# Altium schematic sheet 工大宣区_气温.SchDoc
size A4
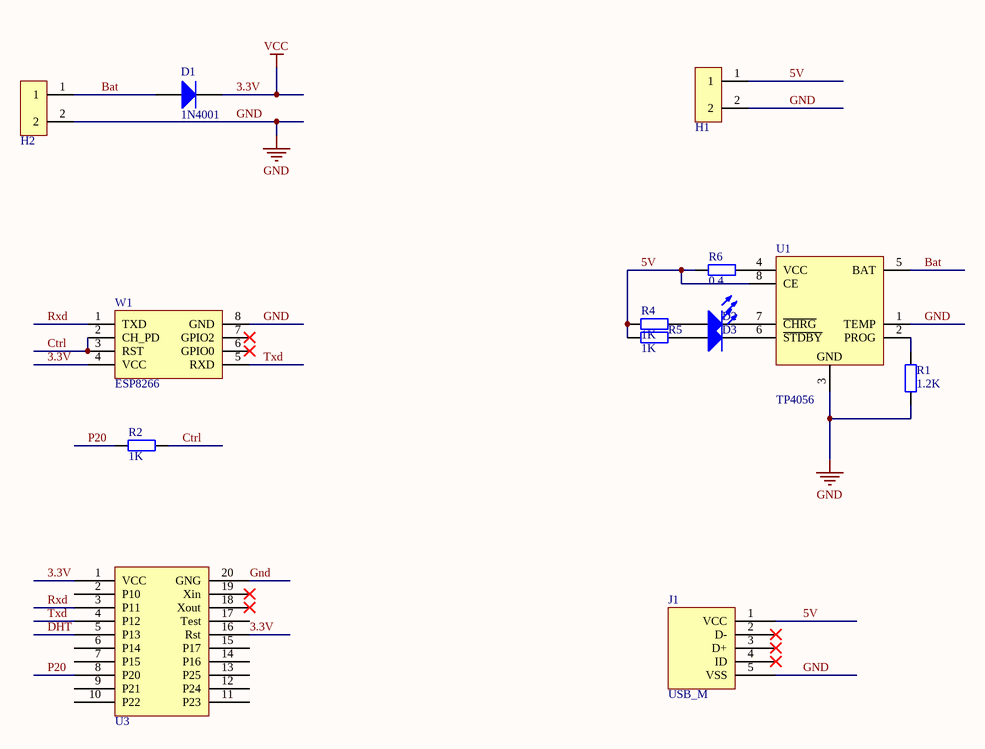
[diagram p0: 工大宣区_气温.SchDoc]

## Parts
D1  Type: 1N4001  [DIODE-1206]  (hidden comment: Diode)
D2  LED0  [LED_A2]  (value not drawn)
D3  LED0  [LED_A2]  (value not drawn)
H1  Header_2_5.04  [Header_2_5.04]  (value not drawn)
H2  Header_2_5.04  [Header_2_5.04]  (value not drawn)
J1  USB_M  [USB_MICRO]
R1  value 1.2K  [0805-1]  (hidden comment: Res1)
R2  value 1K  [0805-1]  (hidden comment: Res1)
R4  value 1K  [0805-1]  (hidden comment: Res1)
R5  value 1K  [0805-1]  (hidden comment: Res1)
R6  value 0.4  [0805-1]  (hidden comment: Res1)
U1  TP4056  [NSO8_TP4056]
U3  msp430G2  [DIP20]  (value not drawn)
W1  ESP8266  [ESP8266]

## Nets
3.3V: D1.2(K) U3.1(VCC) U3.16(Rst) W1.4(VCC)  [also labelled VCC]
GND: H1.2 H2.2 J1.5(VSS) R1.1 U1.1(TEMP) U1.3(GND) U3.20(GNG) W1.8(GND)
5V: H1.1 J1.1(VCC) R4.2 R5.2 R6.2 U1.8(CE)
Bat: D1.1(A) H2.1 U1.5(BAT)
Ctrl: R2.2 W1.2(CH_PD) W1.3(RST)
DHT: U3.5(P13)
P20: R2.1 U3.8(P20)
Rxd: U3.3(P11) W1.1(TXD)
Txd: U3.4(P12) W1.5(RXD)
NetD2_1: D2.1(A) R4.1
NetD2_2: D2.2(K) U1.7(~{CHRG})
NetD3_1: D3.1(A) R5.1
NetD3_2: D3.2(K) U1.6(~{STDBY})
NetR1_2: R1.2 U1.2(PROG)
NetR6_1: R6.1 U1.4(VCC)

Not connected (* = marked no-connect by the designer): J1 2(D-)* 3(D+)* 4(ID)*; U3 2(P10) 6(P14) 7(P15) 9(P21) 10(P22) 11(P23) 12(P24) 13(P25) 14(P16) 15(P17) 17(Test) 18(Xout)* 19(Xin)*; W1 6(GPIO0)* 7(GPIO2)*

## Library data of the parts
D1 = Diode: 二极管; Published: 8-Jun-2000; LatestRevisionDate: 17-Jul-2002; LatestRevisionNote: Re-released for DXP Platform.; PackageDocument: Sep-1996; PackageReference: SMC; Publisher: Altium Limited; Code_JEDEC: DO-214-AB
D2 D3 = LED0: 发光二极管; Published: 8-Jun-2000; LatestRevisionDate: 08-Jul-2005; LatestRevisionNote: Mech Layer 1 removed.; PackageReference: LED-0; Publisher: Altium Limited
J1 = USB_M: MicroUSB接口
R1 R2 R4-R6 = Res1: 贴片电阻; Published: 8-Jun-2000; LatestRevisionDate: 17-Jul-2002; LatestRevisionNote: Re-released for DXP Platform.; PackageReference: AXIAL-0.4; Publisher: Altium Limited
U1 = TP4056: 锂电池充电管理
W1 = ESP8266-01